# Altium project HYDRA_V3_NAV.PrjPcb (part 2 of 2)

## Sheet GPS.SchDoc
size B; SheetNumber: 6; SheetTotal: 7
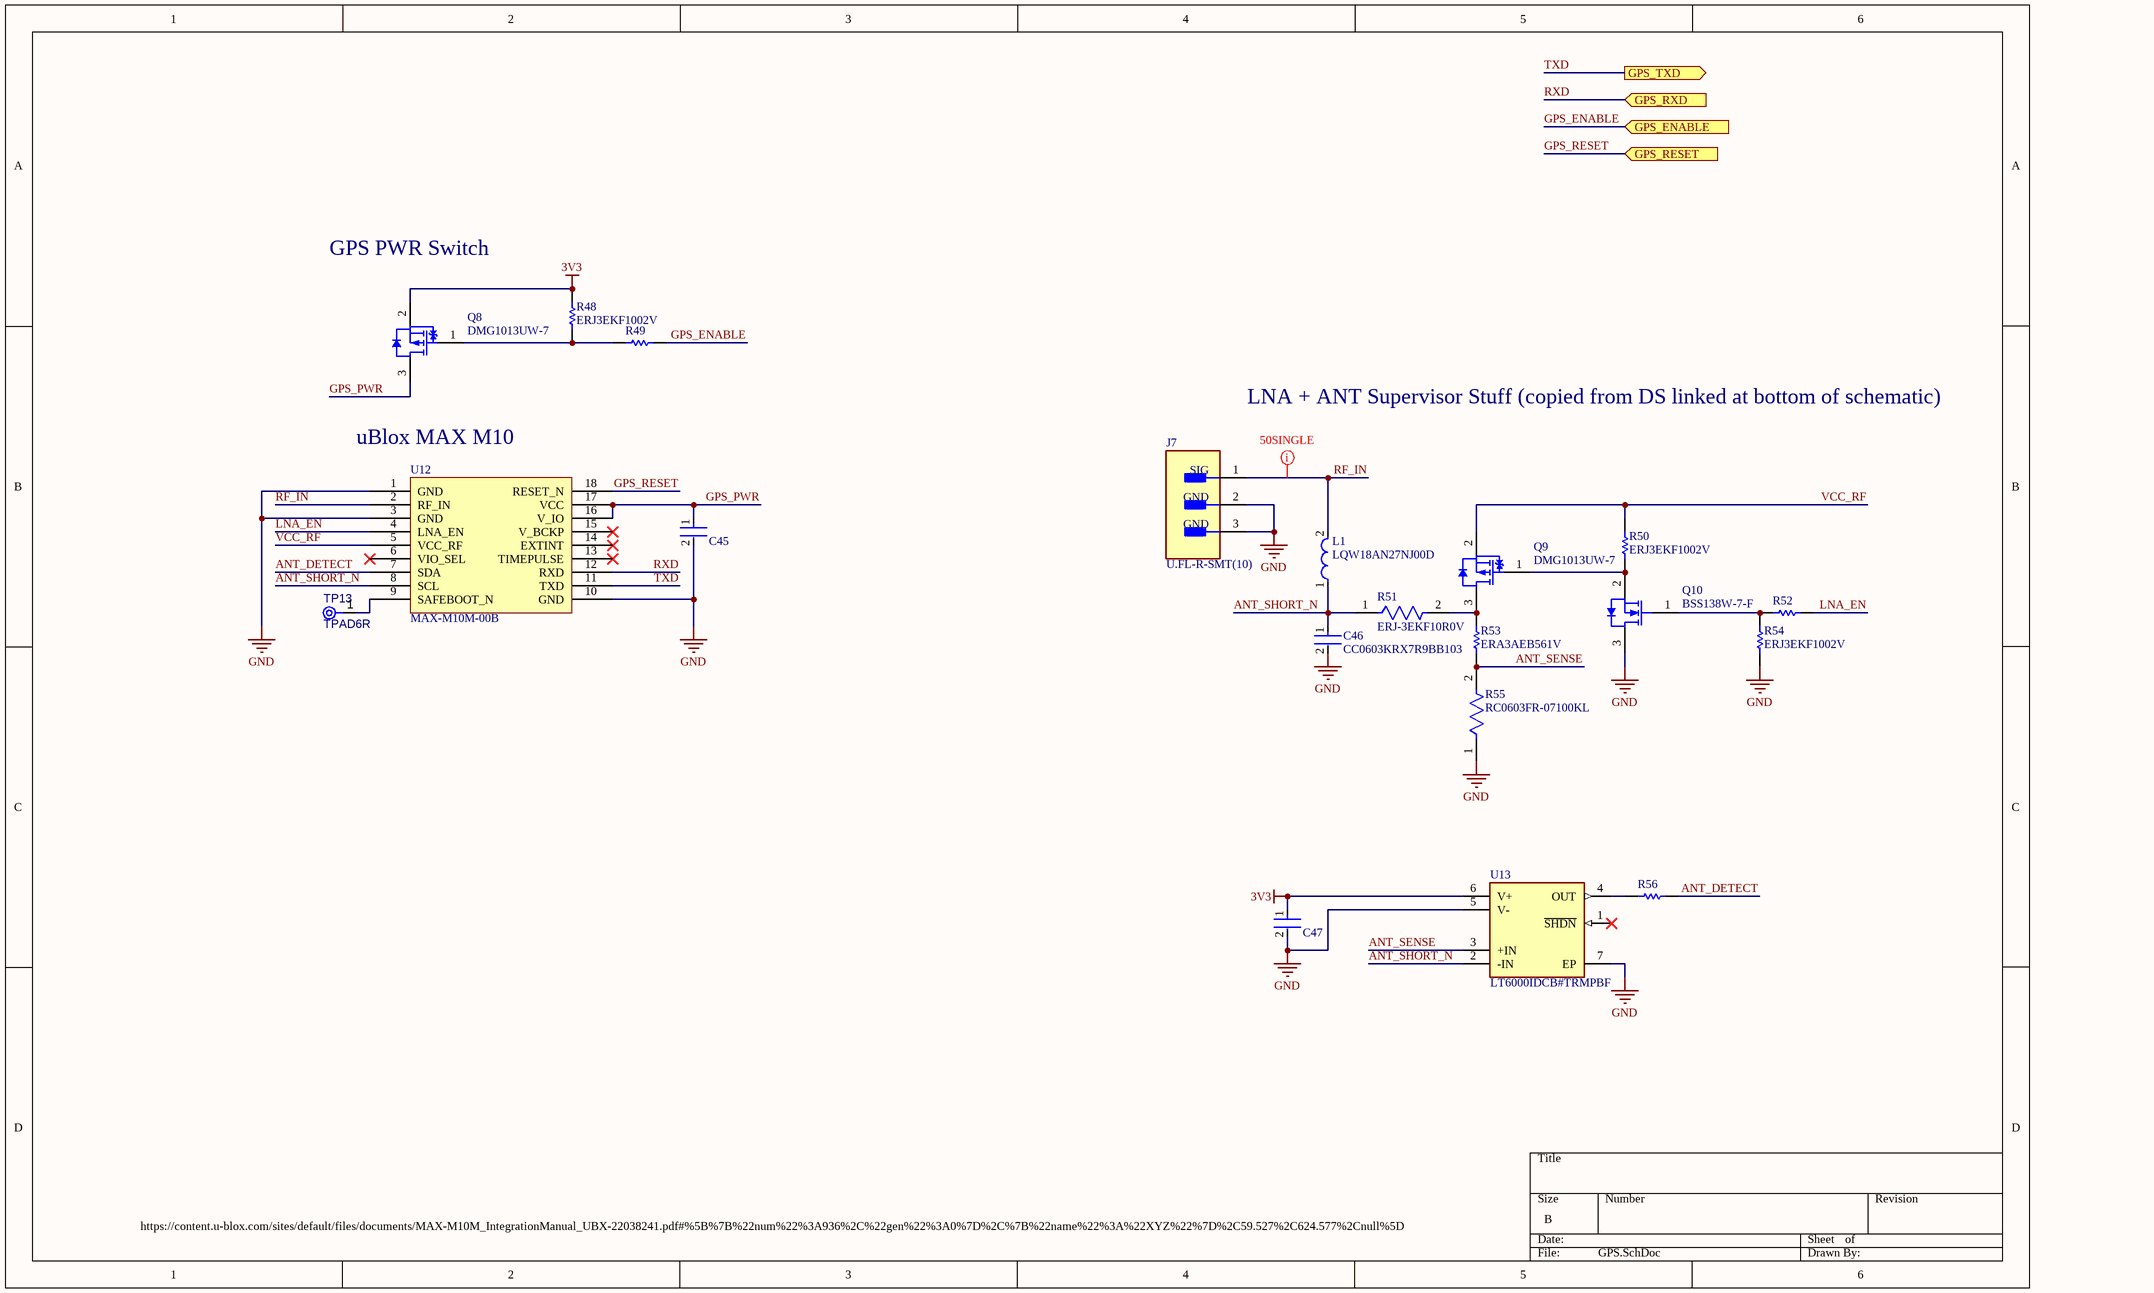
[diagram p6: GPS.SchDoc]

### Parts
C45  C0402C104K8PACTU  [FP-C0402-BB-MFG]  (value not drawn)
C46  CC0603KRX7R9BB103  [FP-CC0603-DA-MFG]
C47  C0402C104K8PACTU  [FP-C0402-BB-MFG]  (value not drawn)
J7  U.FL-R-SMT(10)  [FP-U_FL-R-SMT_10-MFG]
L1  LQW18AN27NJ00D  [FP-LQW18AN_00-MFG]
Q8  DMG1013UW-7  [DIOD-SOT323-3_V]
Q9  DMG1013UW-7  [DIOD-SOT323-3_V]
Q10  BSS138W-7-F  [DIOD-SOT323-3_V]
R48  ERJ3EKF1002V  [RESC1609X55X30LL15T15]
R49  ERJ-3EKF1001V  [RESC1608X55X30LL15T15]  (value not drawn)
R50  ERJ3EKF1002V  [RESC1609X55X30LL15T15]
R51  ERJ-3EKF10R0V  [FP-ERJ3EK-MFG]
R52  ERJ-3EKF1001V  [RESC1608X55X30LL15T15]  (value not drawn)
R53  ERA3AEB561V  [RESC1608X55X30LL20T20]
R54  ERJ3EKF1002V  [RESC1609X55X30LL15T15]
R55  RC0603FR-07100KL  [FP-RC0603-0_55-MFG]
R56  ERJ-3EKF1001V  [RESC1608X55X30LL15T15]  (value not drawn)
TP13  TPAD6R  [TP06R]  (no BOM)
U12  MAX-M10M-00B  [MAX-M10M-00B-Footprint-1]
U13  LT6000IDCB#TRMPBF  [FP-DCB-6-05-08-1715-MFG]

### Ports
GPS_ENABLE (in, see HYDRA_V3_NAV[5B], STM32H730_PINOUT[8A]), GPS_RESET (in, see HYDRA_V3_NAV[5B], STM32H730_PINOUT[8A]), GPS_RXD (in, see HYDRA_V3_NAV[5B]), GPS_TXD (out, see HYDRA_V3_NAV[5B])

### Nets
3V3: C47.1 Q8.2(S) R48.2 U13.6(V+)
GND: C45.2 C46.2 C47.2 J7.2(GND) J7.3(GND) Q10.3(D) R54.1 R55.1 U12.1(GND) U12.3(GND) U12.10(GND) U13.5(V-) U13.7(EP)
ANT_DETECT: R56.1 U12.7(SDA)
ANT_SENSE: R53.1 R55.2 U13.3(+IN)
ANT_SHORT_N: C46.1 L1.1 R51.1 U12.8(SCL) U13.2(-IN)
GPS_ENABLE: R49.1 ; port GPS_ENABLE
GPS_PWR: C45.1 Q8.3(D) U12.16(V_IO) U12.17(VCC)
GPS_RESET: U12.18(RESET_N) ; port GPS_RESET
LNA_EN: R52.1 U12.4(LNA_EN)
RF_IN: J7.1(SIG) L1.2 U12.2(RF_IN)
RXD: U12.12(RXD) ; port GPS_RXD
TXD: U12.11(TXD) ; port GPS_TXD
VCC_RF: Q9.2(S) R50.2 U12.5(VCC_RF)
NetQ8_1: Q8.1(G) R48.1 R49.2
NetQ9_1: Q9.1(G) Q10.2(S) R50.1
NetQ9_3: Q9.3(D) R51.2 R53.2
NetQ10_1: Q10.1(G) R52.2 R54.2
NetR56_2: R56.2 U13.4(OUT)
NetTP13_1: TP13.1(TP) U12.9(SAFEBOOT_N)

Not connected (* = marked no-connect by the designer): U12 6(VIO_SEL)* 13(TIMEPULSE)* 14(EXTINT)* 15(V_BCKP)*; U13 1(~{SHDN})*

### Layout directives
net class 50SINGLE: RF_IN

### Notes on the sheet
- GPS PWR Switch
- LNA + ANT Supervisor Stuff (copied from DS linked at bottom of schematic)
- (near U12) uBlox MAX M10
- https://content.u-blox.com/sites/default/files/documents/MAX-M10M_IntegrationManual_UBX-22038241.pdf#%5B%7B%22num%22%3A936%2C%22gen%22%3A0%7D%2C%7B%22name%22%3A%22XYZ%22%7D%2C59.527%2C624.577%2Cnull%5D

### Library data of the parts
C45 C47 = CMP-2008-02046-2: CAP CER 0.1UF 10V X5R 0402; Manufacturer: Kemet; Material: Ceramic; Capacitance: 0.10 μF; Temperature Coefficient: 15%; Tolerance: 0.1; Value: 0.10 μF; Package: C0402-BB; Temperature: -55°C to +125°C; ComponentLink2Description: Datasheet; Temperature Characteristic: X5R; Device Class L1: Passive Components; Height: 0.55mm; Lead Free: Yes; ComponentLink2URL: https://content.kemet.com/datasheets/KEM_C1002_X7R_SMD.pdf; Device Class L2: Capacitors; Temperature Range Low: -55°C; Temperature Range High: +125°C; RoHS: TRUE; Octopart: https://octopart.com/c0402c104k8pactu-kemet-140039; Automotive: No; Mouser Description: Capacitor 100 nF 10 VDC 0402; Category: Cap; Voltage Rating: 10 V; Digikey Description: CAP CER 0.1UF 10V X5R 0402; Ipc Land Pattern Name: CAPC10050X50; Device Class L3: Ceramic Capacitors; Manufacturer Part Number: C0402C104K8PACTU
C46 = CMP-2100-03600-2: CAP CER 10000PF 50V X7R 0603; Manufacturer: YAGEO; Tolerance: 0.1; Material: Ceramic; Temperature Coefficient: 15%; Value: 10 nF; Mouser Description: Multilayer Ceramic Capacitor, CC Series, 0.01 - F, - 10%, X7R, 50 V, 0603 [1608 Metric]; Digikey Description: CAP CER 10000PF 50V X7R 0603; Height: 0.9mm; Category: Cap; Temperature Characteristic: X7R; Footprint Url: http://www.yageo.com/exep/pages/download/literatures/UPY-C_GEN_24.pdf; Lead Free: Yes; Voltage Rating: 50 V; Manufacturer Part Number: CC0603KRX7R9BB103; Temperature: -55°C to +125°C; Device Class L3: Ceramic Capacitors; ComponentLink2Description: Datasheet; Voltage: 50 V; Package: CC0603-DA; Octopart: https://octopart.com/cc0603krx7r9bb103-yageo-192938; Automotive: No; Temperature Range High: +125°C; Temperature Range Low: -55°C; RoHS: TRUE; Device Class L1: Passive Components; ComponentLink2URL: http://www.yageo.com/documents/recent/UPY-GPHC_X7R_6.3V-to-50V_18.pdf; Device Class L2: Capacitors; Capacitance: 10 nF
J7 = CMP-0029-00003-2: CONN U.FL RCPT STR 50 OHM SMD; Plating: Silver; Connector Type: Coaxial; Frequency: 6GHz; Impedance: 50R; Body Material: Bronze; Dielectric Material: Polymer; Contact Plating: Gold; Termination: Solder; Orientation: Vertical; Contact Material: Brass; Min Operating Temperature: -40°C; Mount: Surface Mount; Lead Free: Lead Free; Max Operating Temperature: 90°C; Radiation Hardening: No; Packaging: Tape and Reel; Body Plating: Silver; Fastening Type: Snap; Max Frequency: 6GHz; Depth: 3.1mm; Package Quantity: 1; Case/Package: SMD/SMT; Housing Color: Beige; Length: 3mm
L1 = CMP-06042-013840-1: Wire Wound RF Inductor 27nH ±5% 440mA 0.21Ω 0603 (1608); Shielding: Unshielded; Test Frequency: 100MHz; Q Factor: 40; Self Resonant Frequency: 3.7GHz; DC Resistance (DCR): 210mR; Core Material: Non-Magnetic; Depth: 1mm; Min Operating Temperature: -55°C; Package Quantity: 4000; Inductance: 27nH; Case Code (Metric): 1608; Height - Seated (Max): 0.039inch; Resistor Type: Wirewound; Max DC Current: 440mA; Tolerance: 5%; Length: 1.6mm; Mount: Surface Mount; DC Current: 440mA; Packaging: Tape and Reel; Lead Free: Lead Free; Case Code (Imperial): 0603; Current Rating: 440mA; Width: 0.8mm; Max Operating Temperature: 125°C; Termination: SMD/SMT; Weight: 0.000106oz; Radiation Hardening: No; Height: 0.8mm; Case/Package: 0603; Military Standard: Not
Q8 Q9 = CMP-2000-06170-1: P-Channel Enhancement Mode MOSFET, 310 mW, 20 V, -55 to 150 degC, 3-Pin SOT-323, RoHS, Tape and Reel; Manufacturer: Diodes Inc; Qg Gate Charge: 0.622nC; Drain-Source On Resistance-Max: 750mO; Rated Power Dissipation: 310mW; Drain-to-Source Voltage [Vdss]: 20V; Package Reference: SOT323; Datasheet Version: Rev. 3-2, 09/2013; Package Description: 3-Pin Small Outline Transistor, Body 2 x 1.25 mm, Pitch 0.65 mm; Mounting Technology: SurfaceMount; Manufacturer URL: http://www.diodes.com/; Datasheet URL: http://www.diodes.com/_files/datasheets/ds31861.pdf; Channel Type: P-Channel
Q10 = CMP-2000-05968-1: N-Channel Enhancement Mode Mosfet, 50 V, 200 mA, -55 to 150 degC, 6-Pin SOT-323, RoHS, Tape and Reel; Typical Turn-Off Delay Time: 20ns; Number of Channels: 1Channel; Type: EnhancementModeFieldEffectTransistor; Brand: DiodesIncorporated; Vds - Drain-Source Breakdown Voltage: 75V; Vgs - Gate-Source Voltage: 20V; Rds On - Drain-Source Resistance: 1.4Ohms; Transistor Type: 1N-Channel; Configuration: Single; Unit Weight: 0.000212oz; Pd - Power Dissipation: 200mW; Id - Continuous Drain Current: 200mA; Forward Transconductance - Min: 0.1S; Manufacturer URL: http://www.diodes.com/; Series: BSS138; Package Description: 3-Pin Small Outline Transistor, Body 2 x 1.25 mm, Pitch 0.65 mm; Mounting Technology: SurfaceMount; Product Category: MOSFET; RoHS: True; Maximum Operating Temperature: +150C; Height: 1mm; Length: 2.2mm; Technology: Si; Width: 1.35mm; Datasheet URL: http://www.diodes.com/_files/datasheets/ds30206.pdf; Manufacturer: DiodesIncorporated; Package / Case: SOT-323-3; Typical Turn-On Delay Time: 20ns; Transistor Polarity: N-Channel; Factory Pack Quantity: 3000; Packaging: Reel; Product: MOSFETSmallSignal; Datasheet Version: Rev. 11-2, 09/2013; Package Reference: SOT323; Minimum Operating Temperature: -55C; Mounting Style: SMD/SMT; Channel Mode: Enhancement
R48 R50 R54 = CMP-1012-00623-3: Chip Resistor, 10 KOhm, +/- 1%, 0.1 W, -55 to 155 degC, 0603 (1608 Metric), RoHS, Tape and Reel; Manufacturer: Panasonic; Voltage Rating: 75V; Case\/Package: 0603; Power Rating: 100mW; Resistance: 10KOhm; Temperature Coefficient: 100ppm\/degreesC; Number of Pins: 2; Package Reference: 603; Depth: 0.8mm; Mount: SurfaceMount; Package Description: 2-Pin Surface Mount Device, Body 1.6 x 0.85 mm; Datasheet Version: 02/2017; Length: 1.6mm; Lead Free: LeadFree; Height: 0.45mm; Number of Terminations: 2; Max Power Dissipation: 100mW; Min Operating Temperature: -55degC; Datasheet URL: https://industrial.panasonic.com/cdbs/www-data/pdf/RDA0000/AOA0000C304.pdf; Termination: SMD/SMT; Case Code (Metric): 1608; Case Code (Imperial): 0603; Tolerance: 1%; Max Operating Temperature: 155degC; RoHSCompliant: true; Voltage Rating (DC): 75V; Radiation Hardening: No; Packaging: TapeandReel; Composition: ThickFilm; Mounting Technology: SurfaceMount; Manufacturer URL: http://www.panasonic.com/; Width: 0.031inch; REACH SVHC: NoSVHC; Contact Plating: Tin; Military Standard: Not; Package Quantity: 1
R49 R52 R56 = CMP-2000-00180-1: Manufacturer: Panasonic; Part Number: ERJ-3EKF1001V
R51 = CMP-2000-00195-2: RES SMD 10 OHM 1% 1/10W 0603; Manufacturer: Panasonic; Resistance: 10Ω; Voltage Rating: 75V; Value: 10Ω; Power: 100mW; Power Rating: 0.1W; Temperature Coefficient: 100ppm/°C; Automotive Grade: Grade 0; Lead Free: Yes; Device Class L1: Passive Components; Digikey Description: RES SMD 10 OHM 1% 1/10W 0603; Octopart: https://octopart.com/erj-3ekf10r0v-panasonic-55403649; Automotive: Yes; ComponentLink2URL: https://b2b-api.panasonic.eu/file_stream/pids/fileversion/1263; Manufacturer Part Number: ERJ-3EKF10R0V; Height: 0.55mm; Temperature Range High: +155°C; Footprint Url: https://industrial.panasonic.com/cdbs/www-data/pdf/RDA0000/DMA0000COL17.pdf; Temperature: -55°C to +155°C; Tolerance: 1%; ComponentLink2Description: Datasheet; Package: ERJ3EK; Device Class L2: Resistors; Category: Res; Ipc Land Pattern Name: RESC16080X45; RoHS: TRUE; Composition: Thick Film; Device Class L3: Chip SMD Resistors; Temperature Range Low: -55°C; Series: ERJ
R53 = CMP-2000-00091-1: Manufacturer: Panasonic; Part Number: ERA3AEB561V
R55 = CMP-2100-03662-2: RES SMD 100K OHM 1% 1/10W 0603; Voltage Rating (DC): 50V; Resistance: 100kR; Max Power Dissipation: 100mW; Temperature Coefficient: 100ppm/°C; Working Voltage: 75V; Length: 1.6mm; Lead Free: Lead Free; Number of Terminations: 2; Packaging: Tape and Reel; Voltage Rating: 50V; Termination: SMD/SMT; Width: 0.8mm; Resistor Type: Thick Film; Resistance Tolerance: 1%; Features: Moisture Resistant; Height: 0.45mm; Construction: Rectangular; Case/Package: 0603; Military Standard: Not; Case Code (Imperial): 0603; Series: RC; Technology: THICK FILM; Depth: 0.8mm; RoHS Compliant: Yes; REACH SVHC: No SVHC; Min Operating Temperature: -55°C; Case Code (Metric): 1608; Max Operating Temperature: 155°C; Power Rating: 100mW; Number of Pins: 2; Tolerance: 1%
TP13 = CMP-00028-00002-2: 0.6mm round; Pins: 1
U12 = CMP-010-00031-1: Gnss Lcc Rx Mod, Rom, Crystal
U13 = CMP-09116-000039-1: IC OPAMP GP 1 CIRCUIT 6DFN; Number of Elements: 1; Power Supply Rejection Ratio (PSRR): 86dB; Output Current per Channel: 10mA; Gain Bandwidth Product: 60kHz; Operating Supply Current: 20uA; Input Bias Current: 12nA; Voltage Gain: 120dB; Max Supply Voltage: 18V; Input Offset Voltage (Vos): 1.2mV; Min Supply Voltage: 1.8V; Slew Rate: 0.018V/µs; Common Mode Rejection Ratio: 68dB; Packaging: Tape and Reel; Mount: Surface Mount; Case/Package: DFN; Max Operating Temperature: 85°C; Number of Pins: 6; Number of Amplifiers: 1; REACH SVHC: No SVHC; Unity Gain Bandwidth Product: 60kHz; Bandwidth: 60kHz; Lead Free: Lead Free; Number of Circuits: 1; Min Operating Temperature: -40°C; Package Quantity: 1

## Sheet SD.SchDoc
size B; SheetNumber: 5; SheetTotal: 7
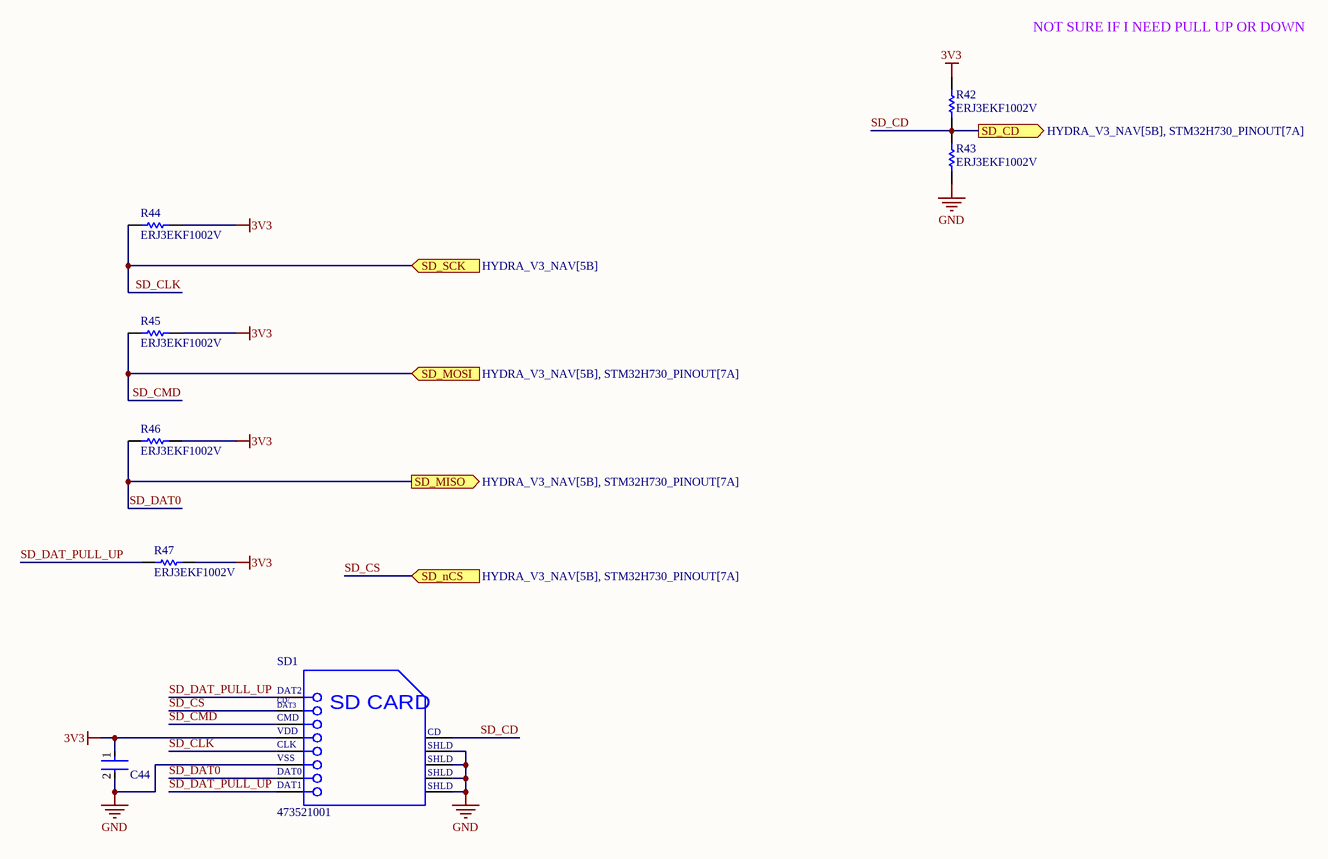
[diagram p7: SD.SchDoc]

### Parts
C44  C0402C104K8PACTU  [FP-C0402-BB-MFG]  (value not drawn)
R42  ERJ3EKF1002V  [RESC1609X55X30LL15T15]
R43  ERJ3EKF1002V  [RESC1609X55X30LL15T15]
R44  ERJ3EKF1002V  [RESC1609X55X30LL15T15]
R45  ERJ3EKF1002V  [RESC1609X55X30LL15T15]
R46  ERJ3EKF1002V  [RESC1609X55X30LL15T15]
R47  ERJ3EKF1002V  [RESC1609X55X30LL15T15]
SD1  473521001  [MOLX-473521001_V]

### Ports
SD_CD (out, see HYDRA_V3_NAV[5B], STM32H730_PINOUT[7A]), SD_MISO (out, see HYDRA_V3_NAV[5B], STM32H730_PINOUT[7A]), SD_MOSI (in, see HYDRA_V3_NAV[5B], STM32H730_PINOUT[7A]), SD_nCS (in, see HYDRA_V3_NAV[5B], STM32H730_PINOUT[7A]), SD_SCK (in, see HYDRA_V3_NAV[5B])

### Nets
3V3: C44.1 R42.2 R44.2 R45.2 R46.2 R47.2 SD1.4(VDD)
GND: C44.2 R43.1 SD1.6(VSS) SD1.10(SHLD) SD1.11(SHLD) SD1.12(SHLD) SD1.13(SHLD)
SD_CD: R42.1 R43.2 SD1.9(CD) ; port SD_CD
SD_CLK: R44.1 SD1.5(CLK) ; port SD_SCK
SD_CMD: R45.1 SD1.3(CMD) ; port SD_MOSI
SD_CS: SD1.2(CD/DAT3) ; port SD_nCS
SD_DAT0: R46.1 SD1.7(DAT0) ; port SD_MISO
SD_DAT_PULL_UP: R47.1 SD1.1(DAT2) SD1.8(DAT1)

### Notes on the sheet
- NOT SURE IF I NEED PULL UP OR DOWN
- (in symbol CMP-2000-05848-1) CD/; DAT3; SD CARD

### Library data of the parts
C44 = CMP-2008-02046-2: as C45 on sheet GPS; Package: C0402-BB; Temperature: -55°C to +125°C; ComponentLink2Description: Datasheet; Temperature Characteristic: X5R; Device Class L1: Passive Components; Height: 0.55mm; Lead Free: Yes; ComponentLink2URL: https://content.kemet.com/datasheets/KEM_C1002_X7R_SMD.pdf; Device Class L2: Capacitors; Temperature Range Low: -55°C; Temperature Range High: +125°C; RoHS: TRUE; Octopart: https://octopart.com/c0402c104k8pactu-kemet-140039; Automotive: No; Mouser Description: Capacitor 100 nF 10 VDC 0402; Category: Cap; Voltage Rating: 10 V; Digikey Description: CAP CER 0.1UF 10V X5R 0402; Ipc Land Pattern Name: CAPC10050X50; Device Class L3: Ceramic Capacitors; Manufacturer Part Number: C0402C104K8PACTU
R42-R47 = CMP-1012-00623-3: as R48 on sheet GPS; Number of Pins: 2; Package Reference: 603; Depth: 0.8mm; Mount: SurfaceMount; Package Description: 2-Pin Surface Mount Device, Body 1.6 x 0.85 mm; Datasheet Version: 02/2017; Length: 1.6mm; Lead Free: LeadFree; Height: 0.45mm; Number of Terminations: 2; Max Power Dissipation: 100mW; Min Operating Temperature: -55degC; Datasheet URL: https://industrial.panasonic.com/cdbs/www-data/pdf/RDA0000/AOA0000C304.pdf; Termination: SMD/SMT; Case Code (Metric): 1608; Case Code (Imperial): 0603; Tolerance: 1%; Max Operating Temperature: 155degC; RoHSCompliant: true; Voltage Rating (DC): 75V; Radiation Hardening: No; Packaging: TapeandReel; Composition: ThickFilm; Mounting Technology: SurfaceMount; Manufacturer URL: http://www.panasonic.com/; Width: 0.031inch; REACH SVHC: NoSVHC; Contact Plating: Tin; Military Standard: Not; Package Quantity: 1
SD1 = CMP-2000-05848-1: MicroSD(TM), Pitch 1.1 mm, 8 Position, Height 1.88 mm, -20 to 85 degC, RoHS, Tape and Reel; Manufacturer: Molex; Datasheet Version: Rev. G, 01/2012; Datasheet URL: http://www.molex.com/pdm_docs/sd/473521001_sd.pdf; Package Reference: 473521001; Manufacturer URL: http://www.molex.com/; Mounting Technology: SurfaceMount; Package Description: MicroSD(TM), Pitch 1.1 mm, 8 Position, Height 1.88 mm

## Sheet OC_PROT.SchDoc
size C; SheetNumber: 2; SheetTotal: 7
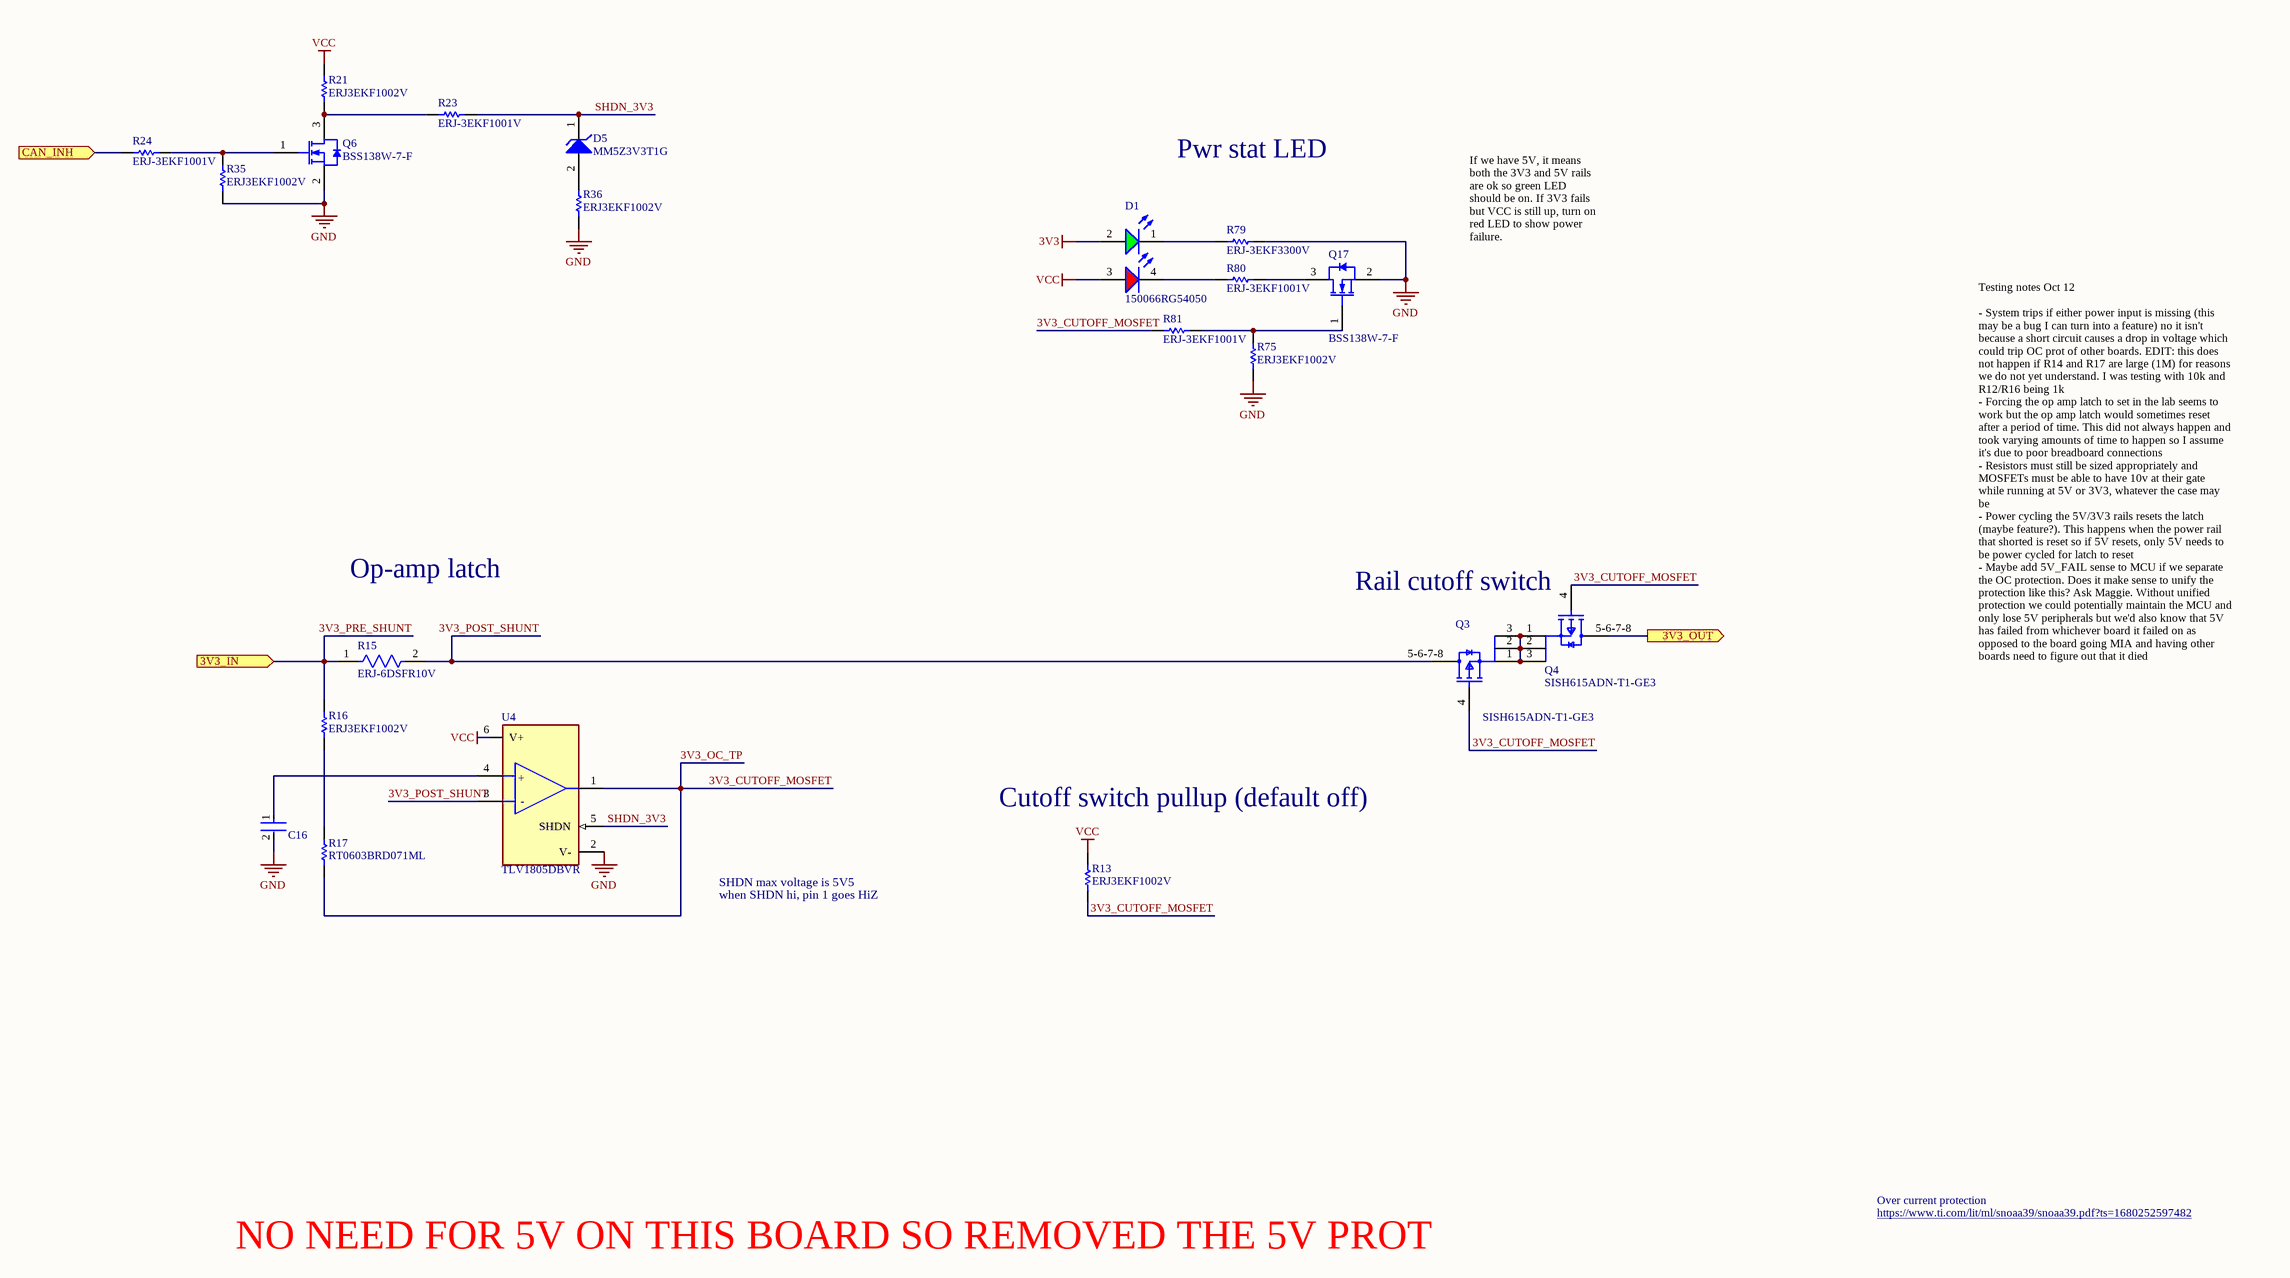
[diagram p8: OC_PROT.SchDoc]

### Parts
C16  C0402C104K8PACTU  [FP-C0402-BB-MFG]  (value not drawn)
D1  150066RG54050  [WL-SBCD_0606]
D5  MM5Z3V3T1G  [ONSC-SOD-523-2-502-01_V]
Q3  SISH615ADN-T1-GE3  [SISH615ADN-T1-GE3-Footprint-1]
Q4  SISH615ADN-T1-GE3  [SISH615ADN-T1-GE3-Footprint-1]
Q6  BSS138W-7-F  [DIOD-SOT323-3_V]
Q17  BSS138W-7-F  [DIOD-SOT323-3_V]
R13  ERJ3EKF1002V  [RESC1609X55X30LL15T15]
R15  ERJ-6DSFR10V  [FP-ERJ6D-MFG]
R16  ERJ3EKF1002V  [RESC1609X55X30LL15T15]
R17  RT0603BRD071ML  [RESC1608X55X30NL20T20]
R21  ERJ3EKF1002V  [RESC1609X55X30LL15T15]
R23  ERJ-3EKF1001V  [RESC1608X55X30LL15T15]
R24  ERJ-3EKF1001V  [RESC1608X55X30LL15T15]
R35  ERJ3EKF1002V  [RESC1609X55X30LL15T15]
R36  ERJ3EKF1002V  [RESC1609X55X30LL15T15]
R75  ERJ3EKF1002V  [RESC1609X55X30LL15T15]
R79  ERJ-3EKF3300V  [RESC1608X55X30LL15T15]
R80  ERJ-3EKF1001V  [RESC1608X55X30LL15T15]
R81  ERJ-3EKF1001V  [RESC1608X55X30LL15T15]
U4  TLV1805DBVR  [FP-DBV0006A-IPC_C]

### Ports
3V3_IN (in, see HYDRA_V3_NAV[3A]), 3V3_OUT (out, see HYDRA_V3_NAV[3A]), CAN_INH (in, see HYDRA_V3_NAV[3A], STM32H730_PINOUT[8A])

### Nets
3V3: D1.2(A) Q4.5-6-7-8(D) ; port 3V3_OUT
GND: C16.2 Q6.2(S) Q17.2(S) R35.1 R36.1 R75.1 R79.2 U4.2(V-)
VCC: D1.3(A) R13.1 R21.2 U4.6(V+)
3V3_CUTOFF_MOSFET: Q3.4(G) Q4.4(G) R13.2 R17.1 R81.2 U4.1(OUT)  [also labelled 3V3_OC_TP]
3V3_POST_SHUNT: Q3.5-6-7-8(D) R15.2 U4.3(-IN)
3V3_PRE_SHUNT: R15.1 R16.2 ; port 3V3_IN
CAN_INH: R24.2 ; port CAN_INH
SHDN_3V3: D5.1(K) R23.2 U4.5(SHDN)
NetC16_1: C16.1 U4.4(+IN)
NetD1_1: D1.1(K) R79.1
NetD1_4: D1.4(K) R80.2
NetD5_2: D5.2(A) R36.2
NetQ3_1: Q3.1(S) Q3.2(S) Q3.3(S) Q4.1(S) Q4.2(S) Q4.3(S)
NetQ6_1: Q6.1(G) R24.1 R35.2
NetQ6_3: Q6.3(D) R21.1 R23.1
NetQ17_1: Q17.1(G) R75.2 R81.1
NetQ17_3: Q17.3(D) R80.1
NetR16_1: R16.1 R17.2

### Notes on the sheet
- Pwr stat LED
- If we have 5V, it means both the 3V3 and 5V rails are ok so green LED should be on. If 3V3 fails but VCC is still up, turn on red LED to show power failure.
- Op-amp latch
- (near Q4) Rail cutoff switch
- Testing notes Oct 12
  - System trips if either power input is missing (this may be a bug I can turn into a feature) no it isn't because a short circuit causes a drop in voltage which could trip OC prot of other boards. EDIT: this does not happen if R14 and R17 are large (1M) for reasons we do not yet understand. I was testing with 10k and R12/R16 being 1k
  - Forcing the op amp latch to set in the lab seems to work but the op amp latch would sometimes reset after a period of time. This did not always happen and took varying amounts of time to happen so I assume it's due to poor breadboard connections
  - Resistors must still be sized appropriately and MOSFETs must be able to have 10v at their gate while running at 5V or 3V3, whatever the case may be
  - Power cycling the 5V/3V3 rails resets the latch (maybe feature?). This happens when the power rail that shorted is reset so if 5V resets, only 5V needs to be power cycled for latch to reset
  - Maybe add 5V_FAIL sense to MCU if we separate the OC protection. Does it make sense to unify the protection like this? Ask Maggie. Without unified protection we could potentially maintain the MCU and only lose 5V peripherals but we'd also know that 5V has failed from whichever board it failed on as opposed to the board going MIA and having other boards need to figure out that it died
- Cutoff switch pullup (default off)
- SHDN max voltage is 5V5
- when SHDN hi, pin 1 goes HiZ
- NO NEED FOR 5V ON THIS BOARD SO REMOVED THE 5V PROT
- https://www.ti.com/lit/ml/snoaa39/snoaa39.pdf?ts=1680252597482
- Over current protection
- (in symbol CMP-04896-000098-1) +; -

### Library data of the parts
C16 = CMP-2008-02046-2: as C45 on sheet GPS; Package: C0402-BB; Temperature: -55°C to +125°C; ComponentLink2Description: Datasheet; Temperature Characteristic: X5R; Device Class L1: Passive Components; Height: 0.55mm; Lead Free: Yes; ComponentLink2URL: https://content.kemet.com/datasheets/KEM_C1002_X7R_SMD.pdf; Device Class L2: Capacitors; Temperature Range Low: -55°C; Temperature Range High: +125°C; RoHS: TRUE; Octopart: https://octopart.com/c0402c104k8pactu-kemet-140039; Automotive: No; Mouser Description: Capacitor 100 nF 10 VDC 0402; Category: Cap; Voltage Rating: 10 V; Digikey Description: CAP CER 0.1UF 10V X5R 0402; Ipc Land Pattern Name: CAPC10050X50; Device Class L3: Ceramic Capacitors; Manufacturer Part Number: C0402C104K8PACTU
D1 = CMP-004-00040-2: Led, Red/Grn, 180Mcd/230Mcd, 624Nm/525Nm Rohs Compliant: Yes; Source: rgled.SchLib; Component Type: Standard; Design Item ID: CMP-004-00034-2; Pins: 4
D5 = CMP-1060-00750-1: Zener Voltage Regulator, 500 mW, 2-Pin SOD-523, Pb-Free, Tape and Reel; Manufacturer: On Semiconductor; P Max (W): 0.5; VZ Typ (V): 3.3; RoHS: Pb-Free; ComponentLink2Description: Datasheet; PackageReference: SOD-523-2-502-01; DatasheetVersion: Rev. 10; ComponentLink1Description: Manufacturer URL; PackageVersion: Rev. E, 09/2010; ComponentLink3URL: http://www.onsemi.com/pub_link/Collateral/502-01.PDF; ComponentLink2URL: http://www.onsemi.cn/pub_link/Collateral/MM5Z2V4T1-D.PDF; Mounting Technology: Surface Mount; PartNumber: MM5Z3V3T1G; Packing: Tape and Reel; PackageDescription: 2-Pin SOD, Body 1.2 x 0.8 mm; ComponentLink1URL: http://www.onsemi.com/; ComponentLink3Description: Package Specification
Q3 Q4 = CMP-013-00036-1: Trans MOSFET P-CH 20V 22.1A 8-Pin PowerPAK 1212 EP T/R
Q6 Q17 = CMP-2000-05968-1: as Q10 on sheet GPS; Manufacturer URL: http://www.diodes.com/; Series: BSS138; Package Description: 3-Pin Small Outline Transistor, Body 2 x 1.25 mm, Pitch 0.65 mm; Mounting Technology: SurfaceMount; Product Category: MOSFET; RoHS: True; Maximum Operating Temperature: +150C; Height: 1mm; Length: 2.2mm; Technology: Si; Width: 1.35mm; Datasheet URL: http://www.diodes.com/_files/datasheets/ds30206.pdf; Manufacturer: DiodesIncorporated; Package / Case: SOT-323-3; Typical Turn-On Delay Time: 20ns; Transistor Polarity: N-Channel; Factory Pack Quantity: 3000; Packaging: Reel; Product: MOSFETSmallSignal; Datasheet Version: Rev. 11-2, 09/2013; Package Reference: SOT323; Minimum Operating Temperature: -55C; Mounting Style: SMD/SMT; Channel Mode: Enhancement
R13 R16 R21 R35 R36 R75 = CMP-1012-00623-3: as R48 on sheet GPS; Number of Pins: 2; Package Reference: 603; Depth: 0.8mm; Mount: SurfaceMount; Package Description: 2-Pin Surface Mount Device, Body 1.6 x 0.85 mm; Datasheet Version: 02/2017; Length: 1.6mm; Lead Free: LeadFree; Height: 0.45mm; Number of Terminations: 2; Max Power Dissipation: 100mW; Min Operating Temperature: -55degC; Datasheet URL: https://industrial.panasonic.com/cdbs/www-data/pdf/RDA0000/AOA0000C304.pdf; Termination: SMD/SMT; Case Code (Metric): 1608; Case Code (Imperial): 0603; Tolerance: 1%; Max Operating Temperature: 155degC; RoHSCompliant: true; Voltage Rating (DC): 75V; Radiation Hardening: No; Packaging: TapeandReel; Composition: ThickFilm; Mounting Technology: SurfaceMount; Manufacturer URL: http://www.panasonic.com/; Width: 0.031inch; REACH SVHC: NoSVHC; Contact Plating: Tin; Military Standard: Not; Package Quantity: 1
R15 = CMP-05422-000098-1: RES 0.1 OHM 1% 1/2W 0805; Temperature Coefficient: 150ppm/°C; Resistance: 100mR; Max Power Dissipation: 500mW; Tolerance: 1%; Length: 0.079inch; Features: Automotive AEC-Q200; Width: 0.049inch; Resistor Type: Thick Film; Case Code (Metric): 2012; Number of Terminations: 2; Max Operating Temperature: 155°C; Case/Package: 0805; Height: 0.028inch; Packaging: Cut Tape; Case Code (Imperial): 0805; Min Operating Temperature: -55°C
R17 = CMP-2000-00925-1: NOT PANASONIC, THIS IS A 1M RESISTORhttps://www.yageo.com/upload/media/product/productsearch/datasheet/rchip/PYu-RT_1-to-0.01_RoHS_L_13.pdf; Part Number: ERA-3AEB163V; Manufacturer: Panasonic
R23 R24 R80 R81 = CMP-2000-00180-1: Manufacturer: Panasonic; Part Number: ERJ-3EKF1001V
R79 = CMP-2000-00435-2: Chip Resistor, 330 Ohm, +/- 1%, 0.1 W, -55 to 155 degC, 0603 (1608 Metric), RoHS, Tape and Reel; Gender: Male; Mating Cycles: 10000; Current Rating: 500 mA; Voltage Rating: 10 V; REACH SVHC: No SVHC; PackageDescription: 2-Pin Surface Mount Device, Body 1.6 x 0.85 mm; Contact Finish: Gold; Pins: 8; ComponentLink1Description: Manufacturer URL; Packaging: Tape and Reel; Max Operating Temperature: 85 degC; Contact Material: Copper; Height: 1.45 mm; Width: 1.45 mm; DatasheetVersion: Apr-15; Package Quantity: 1500; Contact Plating: Gold; PackageReference: 0603; Mount: Surface Mount; Lead Pitch: 1.1 mm; Min Operating Temperature: -25 degC; ComponentLink1URL: http://www.panasonic.com/; ComponentLink2URL: http://industrial.panasonic.com/cdbs/www-data/pdf/RDA0000/AOA0000C86.pdf; Length: 13.7 mm; ComponentLink2Description: Datasheet; RoHSCompliant: true
U4 = CMP-04896-000098-1: 40V, RAIL-TO-RAIL INPUT, PUSH-PU

## Sheet ACTUATOR_PWR_PROT.SchDoc
size B; SheetNumber: 7; SheetTotal: 7
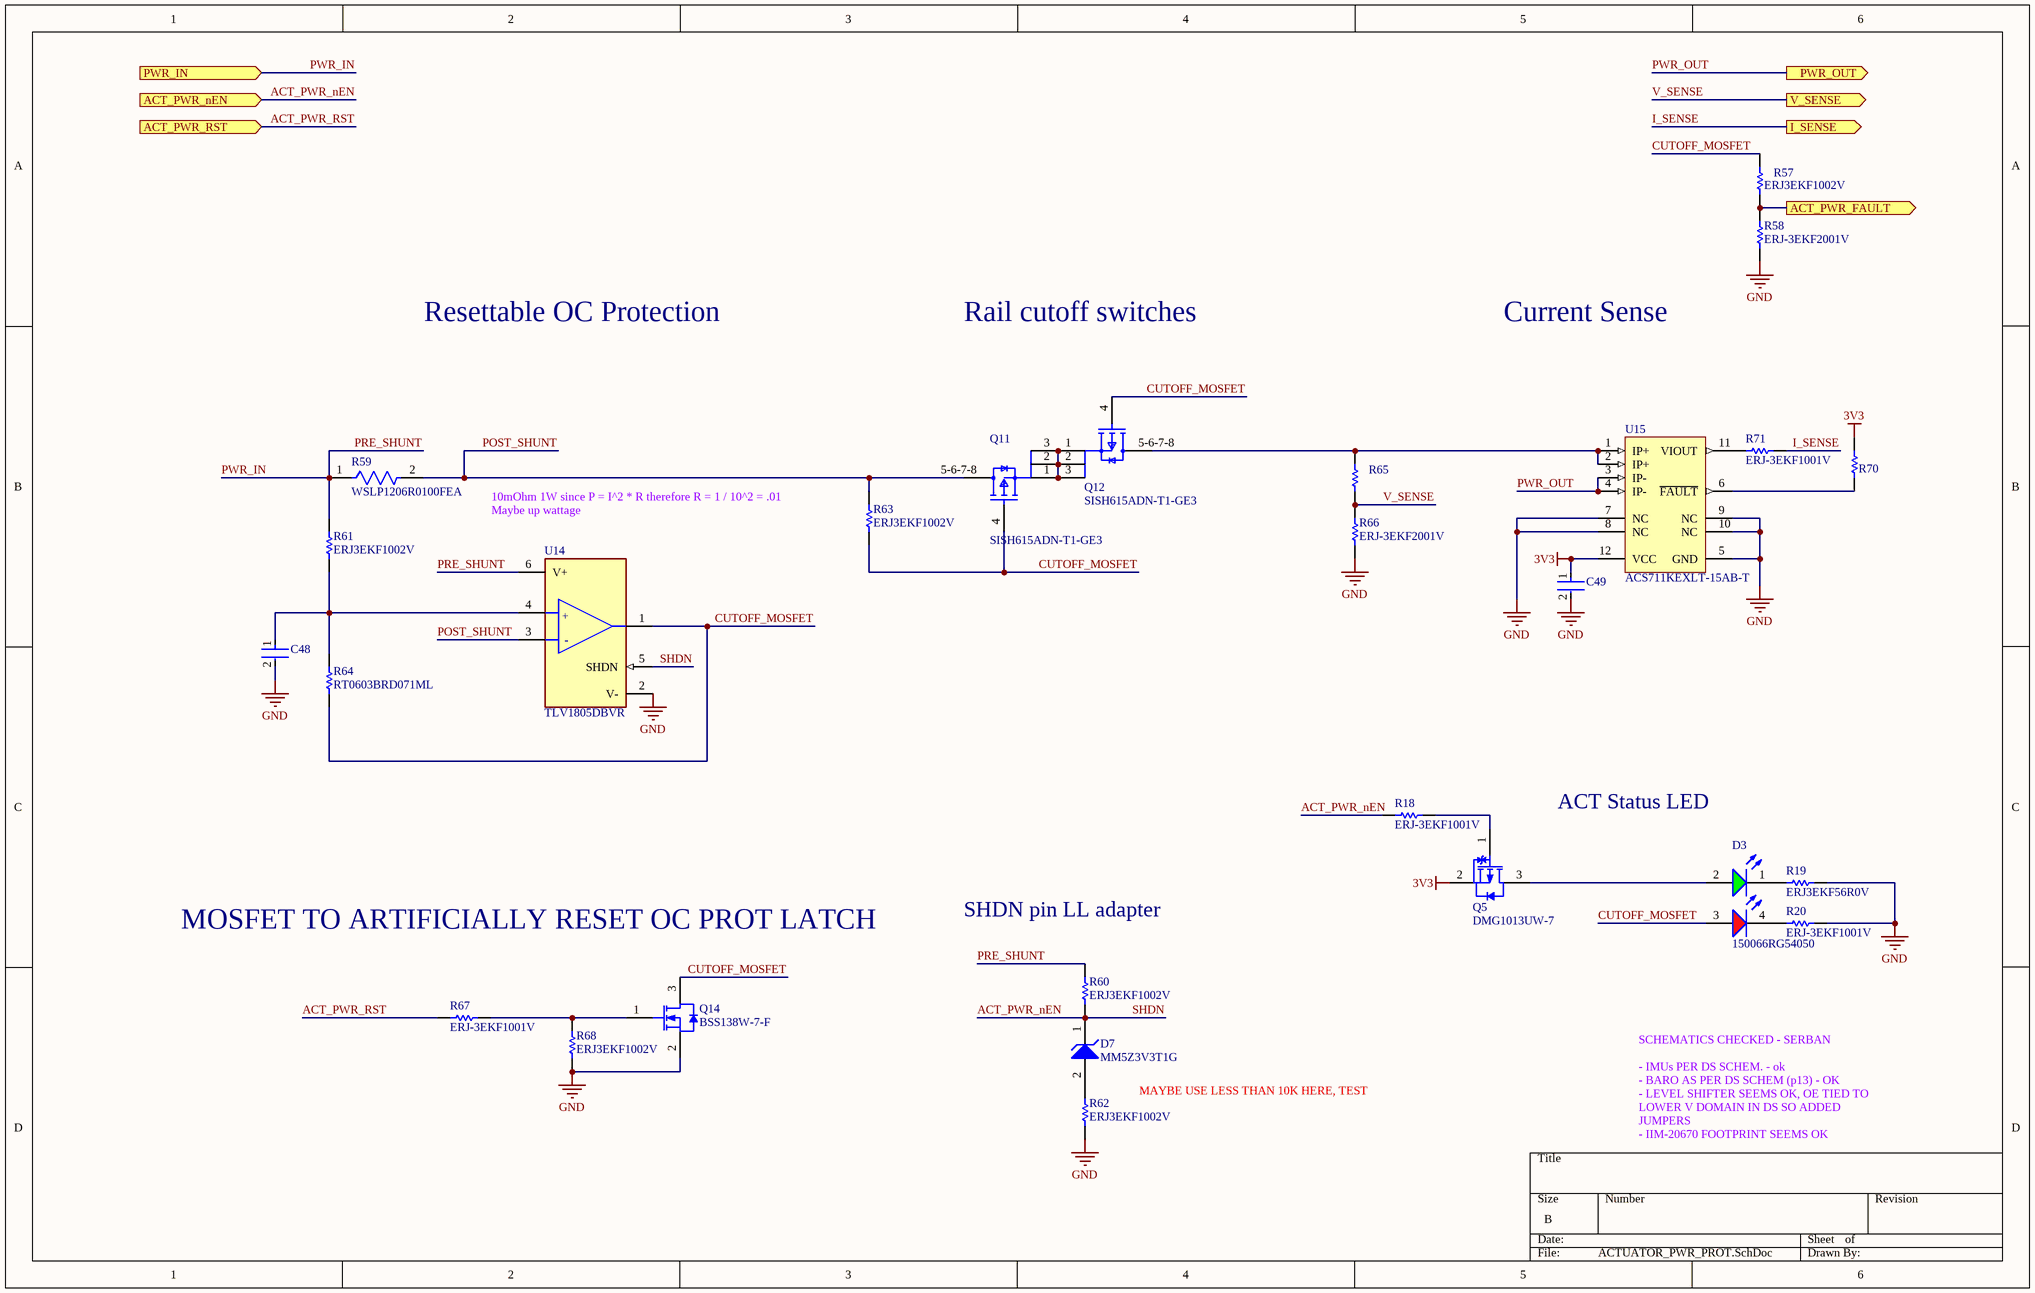
[diagram p9: ACTUATOR_PWR_PROT.SchDoc]

### Parts
C48  GRM188R71H104KA93D  [FP-0402-L_1_0_0_05-W_0_5-IPC_A]  (value not drawn)
C49  GRM188R71H104KA93D  [FP-0402-L_1_0_0_05-W_0_5-IPC_A]  (value not drawn)
D3  150066RG54050  [WL-SBCD_0606]
D7  MM5Z3V3T1G  [ONSC-SOD-523-2-502-01_V]
Q5  DMG1013UW-7  [DIOD-SOT323-3_V]
Q11  SISH615ADN-T1-GE3  [SISH615ADN-T1-GE3-Footprint-1]
Q12  SISH615ADN-T1-GE3  [SISH615ADN-T1-GE3-Footprint-1]
Q14  BSS138W-7-F  [DIOD-SOT323-3_V]
R18  ERJ-3EKF1001V  [RESC1608X55X30LL15T15]
R19  ERJ3EKF56R0V  [RESC1608X55X30NL15T15]
R20  ERJ-3EKF1001V  [RESC1608X55X30LL15T15]
R57  ERJ3EKF1002V  [RESC1609X55X30LL15T15]
R58  ERJ-3EKF2001V  [RESC1608X55X30ML15T15]
R59  WSLP1206R0100FEA  [FP-WSLP1206-FP_1_65x1_93x-MFG]
R60  ERJ3EKF1002V  [RESC1609X55X30LL15T15]
R61  ERJ3EKF1002V  [RESC1609X55X30LL15T15]
R62  ERJ3EKF1002V  [RESC1609X55X30LL15T15]
R63  ERJ3EKF1002V  [RESC1609X55X30LL15T15]
R64  RT0603BRD071ML  [RESC1608X55X30NL20T20]
R65  ERJ3EKF1002V  [RESC1609X55X30LL15T15]  (value not drawn)
R66  ERJ-3EKF2001V  [RESC1608X55X30ML15T15]
R67  ERJ-3EKF1001V  [RESC1608X55X30LL15T15]
R68  ERJ3EKF1002V  [RESC1609X55X30LL15T15]
R70  ERJ3EKF1002V  [RESC1609X55X30LL15T15]  (value not drawn)
R71  ERJ-3EKF1001V  [RESC1608X55X30LL15T15]
U14  TLV1805DBVR  [FP-DBV0006A-IPC_C]
U15  ACS711KEXLT-15AB-T  [ALEG-EX-12_V]

### Ports
ACT_PWR_FAULT (out, see HYDRA_V3_NAV[3B], STM32H730_PINOUT[8A]), ACT_PWR_nEN (in), ACT_PWR_RST (in), I_SENSE (out, see HYDRA_V3_NAV[3B], STM32H730_PINOUT[8A]), PWR_IN (in, see HYDRA_V3_NAV[3A]), PWR_OUT (out, see HYDRA_V3_NAV[3B]), V_SENSE (out, see HYDRA_V3_NAV[3B], STM32H730_PINOUT[8A])

### Nets
3V3: C49.1 Q5.2(S) R70.2 U15.12(VCC)
GND: C48.2 C49.2 Q14.2(S) R19.1 R20.2 R58.1 R62.1 R66.1 R68.1 U14.2(V-) U15.5(GND) U15.7(NC) U15.8(NC) U15.9(NC) U15.10(NC)
ACT_PWR_FAULT: R57.2 R58.2 ; port ACT_PWR_FAULT
ACT_PWR_nEN: D7.1(K) R18.1 R60.1 U14.5(SHDN) ; port ACT_PWR_nEN  [also labelled SHDN]
ACT_PWR_RST: R67.2 ; port ACT_PWR_RST
CUTOFF_MOSFET: D3.3(A) Q11.4(G) Q12.4(G) Q14.3(D) R57.1 R63.1 R64.1 U14.1(OUT)
I_SENSE: R71.2 ; port I_SENSE
POST_SHUNT: Q11.5-6-7-8(D) R59.2 R63.2 U14.3(-IN)
PRE_SHUNT: R59.1 R60.2 R61.2 U14.6(V+) ; port PWR_IN  [also labelled PWR_IN]
PWR_OUT: U15.3(IP-) U15.4(IP-) ; port PWR_OUT  [project net ACT_PWR]
V_SENSE: R65.2 R66.2 ; port V_SENSE
NetC48_1: C48.1 R61.1 R64.2 U14.4(+IN)
NetD3_1: D3.1(K) R19.2
NetD3_2: D3.2(A) Q5.3(D)
NetD3_4: D3.4(K) R20.1
NetD7_2: D7.2(A) R62.2
NetQ5_1: Q5.1(G) R18.2
NetQ11_1: Q11.1(S) Q11.2(S) Q11.3(S) Q12.1(S) Q12.2(S) Q12.3(S)
NetQ12_5-6-7-8: Q12.5-6-7-8(D) R65.1 U15.1(IP+) U15.2(IP+)
NetQ14_1: Q14.1(G) R67.1 R68.2
NetR70_1: R70.1 U15.6(~{FAULT})
NetR71_1: R71.1 U15.11(VIOUT)

### Notes on the sheet
- Resettable OC Protection
- Rail cutoff switches
- Current Sense
- (near R63) 10mOhm 1W since P = I^2 * R therefore R = 1 / 10^2 = .01
- Maybe up wattage
- ACT Status LED
- MOSFET TO ARTIFICIALLY RESET OC PROT LATCH
- SHDN pin LL adapter
- MAYBE USE LESS THAN 10K HERE, TEST
- SCHEMATICS CHECKED - SERBAN
  - IMUs PER DS SCHEM. - ok
  - BARO AS PER DS SCHEM (p13) - OK
  - LEVEL SHIFTER SEEMS OK, OE TIED TO LOWER V DOMAIN IN DS SO ADDED JUMPERS
  - IIM-20670 FOOTPRINT SEEMS OK
- (in symbol CMP-04896-000098-1) +; -

### Library data of the parts
C48 C49 = CMP-001-00058-1: LARGE PADS, 0402 CAP, CHANGE COMMENT TO MATCH REAL P/N; Capacitor Type: Ceramic; Min Operating Temperature: -55°C; Mounting Technology: Surface Mount; Pins: 2; Case/Package: 0402; RoHS Compliant: Yes; Max Operating Temperature: 85°C
D3 = CMP-004-00034-2: Led, Red/Grn, 180Mcd/230Mcd, 624Nm/525Nm Rohs Compliant: Yes
D7 = CMP-1060-00750-1: as D5 on sheet OC_PROT; RoHS: Pb-Free; ComponentLink2Description: Datasheet; PackageReference: SOD-523-2-502-01; DatasheetVersion: Rev. 10; ComponentLink1Description: Manufacturer URL; PackageVersion: Rev. E, 09/2010; ComponentLink3URL: http://www.onsemi.com/pub_link/Collateral/502-01.PDF; ComponentLink2URL: http://www.onsemi.cn/pub_link/Collateral/MM5Z2V4T1-D.PDF; Mounting Technology: Surface Mount; PartNumber: MM5Z3V3T1G; Packing: Tape and Reel; PackageDescription: 2-Pin SOD, Body 1.2 x 0.8 mm; ComponentLink1URL: http://www.onsemi.com/; ComponentLink3Description: Package Specification
Q5 = CMP-2000-06170-1: as Q8 on sheet GPS; Package Reference: SOT323; Datasheet Version: Rev. 3-2, 09/2013; Package Description: 3-Pin Small Outline Transistor, Body 2 x 1.25 mm, Pitch 0.65 mm; Mounting Technology: SurfaceMount; Manufacturer URL: http://www.diodes.com/; Datasheet URL: http://www.diodes.com/_files/datasheets/ds31861.pdf; Channel Type: P-Channel
Q11 Q12 = CMP-013-00018-2: Trans MOSFET P-CH 20V 22.1A 8-Pin PowerPAK 1212 EP T/R; Source: SISH615ADN-T1-GE3.SchLib; Design Item ID: CMP-013-00036-4; Component Type: Standard; Pins: 5
Q14 = CMP-2000-05968-1: as Q10 on sheet GPS; Manufacturer URL: http://www.diodes.com/; Series: BSS138; Package Description: 3-Pin Small Outline Transistor, Body 2 x 1.25 mm, Pitch 0.65 mm; Mounting Technology: SurfaceMount; Product Category: MOSFET; RoHS: True; Maximum Operating Temperature: +150C; Height: 1mm; Length: 2.2mm; Technology: Si; Width: 1.35mm; Datasheet URL: http://www.diodes.com/_files/datasheets/ds30206.pdf; Manufacturer: DiodesIncorporated; Package / Case: SOT-323-3; Typical Turn-On Delay Time: 20ns; Transistor Polarity: N-Channel; Factory Pack Quantity: 3000; Packaging: Reel; Product: MOSFETSmallSignal; Datasheet Version: Rev. 11-2, 09/2013; Package Reference: SOT323; Minimum Operating Temperature: -55C; Mounting Style: SMD/SMT; Channel Mode: Enhancement
R18 R20 R67 R71 = CMP-2000-00180-1: Manufacturer: Panasonic; Part Number: ERJ-3EKF1001V
R19 = CMP-2000-00572-1: Manufacturer: Panasonic; Part Number: ERJ3EKF56R0V
R57 R60-R63 R65 R68 R70 = CMP-1012-00623-3: as R48 on sheet GPS; Number of Pins: 2; Package Reference: 603; Depth: 0.8mm; Mount: SurfaceMount; Package Description: 2-Pin Surface Mount Device, Body 1.6 x 0.85 mm; Datasheet Version: 02/2017; Length: 1.6mm; Lead Free: LeadFree; Height: 0.45mm; Number of Terminations: 2; Max Power Dissipation: 100mW; Min Operating Temperature: -55degC; Datasheet URL: https://industrial.panasonic.com/cdbs/www-data/pdf/RDA0000/AOA0000C304.pdf; Termination: SMD/SMT; Case Code (Metric): 1608; Case Code (Imperial): 0603; Tolerance: 1%; Max Operating Temperature: 155degC; RoHSCompliant: true; Voltage Rating (DC): 75V; Radiation Hardening: No; Packaging: TapeandReel; Composition: ThickFilm; Mounting Technology: SurfaceMount; Manufacturer URL: http://www.panasonic.com/; Width: 0.031inch; REACH SVHC: NoSVHC; Contact Plating: Tin; Military Standard: Not; Package Quantity: 1
R58 R66 = CMP-2000-00317-1: Manufacturer: Panasonic; Part Number: ERJ-3EKF2001V
R59 = CMP-2003-04373-2: RES 0.01 OHM 1% 1W 1206; Temperature Coefficient: 75ppm/°C; Resistance: 10mR; Features: Moisture Resistant; Case/Package: 1206; Military Standard: Not; Case Code (Imperial): 1206; Power Rating: 1W; Number of Terminations: 2; Lead Free: Lead Free; Number of Pins: 2; Min Operating Temperature: -65°C; Weight: 0.000571oz; Radiation Hardening: No; Series: WSLP; Length: 3.2mm; Termination: SMD/SMT; Mount: Surface Mount; Size Code: 1206; Height: 0.035inch; Case Code (Metric): 3216; Resistance Tolerance: 1%; Contact Plating: Tin; Width: 0.063inch; Construction: Rectangular; Packaging: Tape and Reel; Package Quantity: 1; RoHS Compliant: Yes; Depth: 1.6mm; Tolerance: 1%; Max Operating Temperature: 170°C; Max Power Dissipation: 1W; Resistor Type: Metal Strip
R64 = CMP-2000-00925-1: as R17 on sheet OC_PROT; Manufacturer: Panasonic
U14 = CMP-04896-000098-1: 40V, RAIL-TO-RAIL INPUT, PUSH-PU
U15 = CMP-1557-00001-1: Hall Effect Linear Current Sensor with Overcurrent Fault Output for <100 V Isolation Applications, 3 to 5.5 V, -15.5 to 15.5 A IP, -40 to 125 degC, 12-Pin QFN (EX), RoHS, Tape and Reel; VCC Max: 5.5 V; IP Max: 15.5 A; VCC Min: 3 V; IP Min: -15.5 A; -3dB Bandwidth: 0.1 MHz; PackageDescription: 12-Pin Quad Flat No-Lead, Body 3 x 3 mm, Height 0.8 mm; ComponentLink1URL: http://www.allegromicro.com/; Packing: Tape and Reel; ComponentLink2URL: http://www.allegromicro.com/~/media/Files/Datasheets/ACS711-Datasheet.ashx?la=en; DatasheetVersion: Rev. 3; PartNumber: ACS711KEXLT-15AB-T; ComponentLink2Description: Datasheet; ComponentLink3URL: http://www.allegromicro.com/~/media/Files/Datasheets/ACS711-Datasheet.ashx?la=en; RoHS: TRUE; ComponentLink1Description: Manufacturer URL; ComponentLink3Description: Package Specification; Temperature Max: 125 degC; Mounting Technology: Surface Mount; Temperature Min: -40 degC

## Nets that join several sheets
3V3: STM32H730_PINOUT (30 pins), IMU (14 pins), GPS (C47.1 Q8.2 R48.2 U13.6), SD (7 pins), OC_PROT (D1.2 Q4.5-6-7-8), ACTUATOR_PWR_PROT (C49.1 Q5.2 R70.2 U15.12)
GND: HYDRA_V3_NAV (41 pins), STM32H730_PINOUT (48 pins), IMU (32 pins), GPS (13 pins), SD (7 pins), OC_PROT (8 pins), ACTUATOR_PWR_PROT (15 pins)
VCC: HYDRA_V3_NAV (J1.01 J1.02 J4.01 J4.02), STM32H730_PINOUT (5 pins), OC_PROT (D1.3 R13.1 R21.2 U4.6)
3V3_PRE_SHUNT: HYDRA_V3_NAV (8 pins), OC_PROT (R15.1 R16.2)
ACT_PWR: HYDRA_V3_NAV (J3.6 J3.7 J3.8), ACTUATOR_PWR_PROT (U15.3 U15.4)
BARO_MISO: STM32H730_PINOUT (U1.4), IMU (U9.6)
BARO_MOSI: STM32H730_PINOUT (U1.5), IMU (U9.7)
BARO_nCS: STM32H730_PINOUT (U1.3), IMU (U9.4 U9.5)
BARO_SCLK: STM32H730_PINOUT (U1.1), IMU (U9.8)
CAN0_N: HYDRA_V3_NAV (J1.16 J4.16), STM32H730_PINOUT (R5.2 U6.12)
CAN0_P: HYDRA_V3_NAV (J1.15 J4.15), STM32H730_PINOUT (R5.1 U6.13)
CAN1_N: HYDRA_V3_NAV (J1.20 J4.20), STM32H730_PINOUT (R3.1 U2.6)
CAN1_P: HYDRA_V3_NAV (J1.19 J4.19), STM32H730_PINOUT (R3.2 U2.7)
CAN2_N: HYDRA_V3_NAV (J3.1), STM32H730_PINOUT (R4.1 U5.6)
CAN2_P: HYDRA_V3_NAV (J3.2), STM32H730_PINOUT (R4.2 U5.7)
CAN_INH: STM32H730_PINOUT (U6.7), OC_PROT (R24.2)
GPS_ENABLE: STM32H730_PINOUT (U1.96), GPS (R49.1)
IMU0_MISO: STM32H730_PINOUT (U1.30), IMU (U8.9)
IMU0_MOSI: STM32H730_PINOUT (U1.31), IMU (U8.1)
IMU0_nCS: STM32H730_PINOUT (U1.28), IMU (U8.23)
IMU0_nRESET: STM32H730_PINOUT (U1.83), IMU (R31.1 U8.18)
IMU0_ODR: STM32H730_PINOUT (U1.93), IMU (U8.12)
IMU0_SCLK: STM32H730_PINOUT (U1.29), IMU (U8.24)
IMU1_MISO: STM32H730_PINOUT (U1.79), IMU (U16.13)
IMU1_MOSI: STM32H730_PINOUT (U1.80), IMU (U16.10)
IMU1_nCS: STM32H730_PINOUT (U1.77), IMU (U16.12)
IMU1_ODR: STM32H730_PINOUT (U1.95), IMU (U10.12)
IMU1_SCLK: STM32H730_PINOUT (U1.78), IMU (U16.11)
PRE_SHUNT: HYDRA_V3_NAV (16 pins), ACTUATOR_PWR_PROT (R59.1 R60.2 R61.2 U14.6)
RXD: STM32H730_PINOUT (R84.2), GPS (U12.12)
SD_CD: STM32H730_PINOUT (U1.82), SD (R42.1 R43.2 SD1.9)
SD_CLK: STM32H730_PINOUT (U1.52 U6.8), SD (R44.1 SD1.5)
SD_CMD: STM32H730_PINOUT (U1.54 U6.11), SD (R45.1 SD1.3)
SD_CS: STM32H730_PINOUT (U1.81), SD (SD1.2)
SD_DAT0: STM32H730_PINOUT (U1.53 U6.6), SD (R46.1 SD1.7)
TXD: STM32H730_PINOUT (R83.2), GPS (U12.11)